# Altium schematic sheet I2C_MUX.SchDoc: Metlino
size 420 x 297 mm; CheckedBy: P.Kulik,T.Przywozki,W.Ruclo; Author: G.Kasprowicz; CompanyName: WUT ISE; DrawnBy: G.Kasprowicz; Organization: WUT ISE; Address1: PW ISE; Address2: Nowowiejska 15/19 00-665 Warsaw; Address3: gkasprow@gmail.com; DocumentNumber: 23; Revision: 2; SheetNumber: 23; SheetTotal: 29; ModifiedBy: -; CheckedDate: -; Title2: I2C switch; DivGrp: WUT ISE; Designer: G.Kasprowicz; ModifiedDate: -; ProjectName: Sensor Box
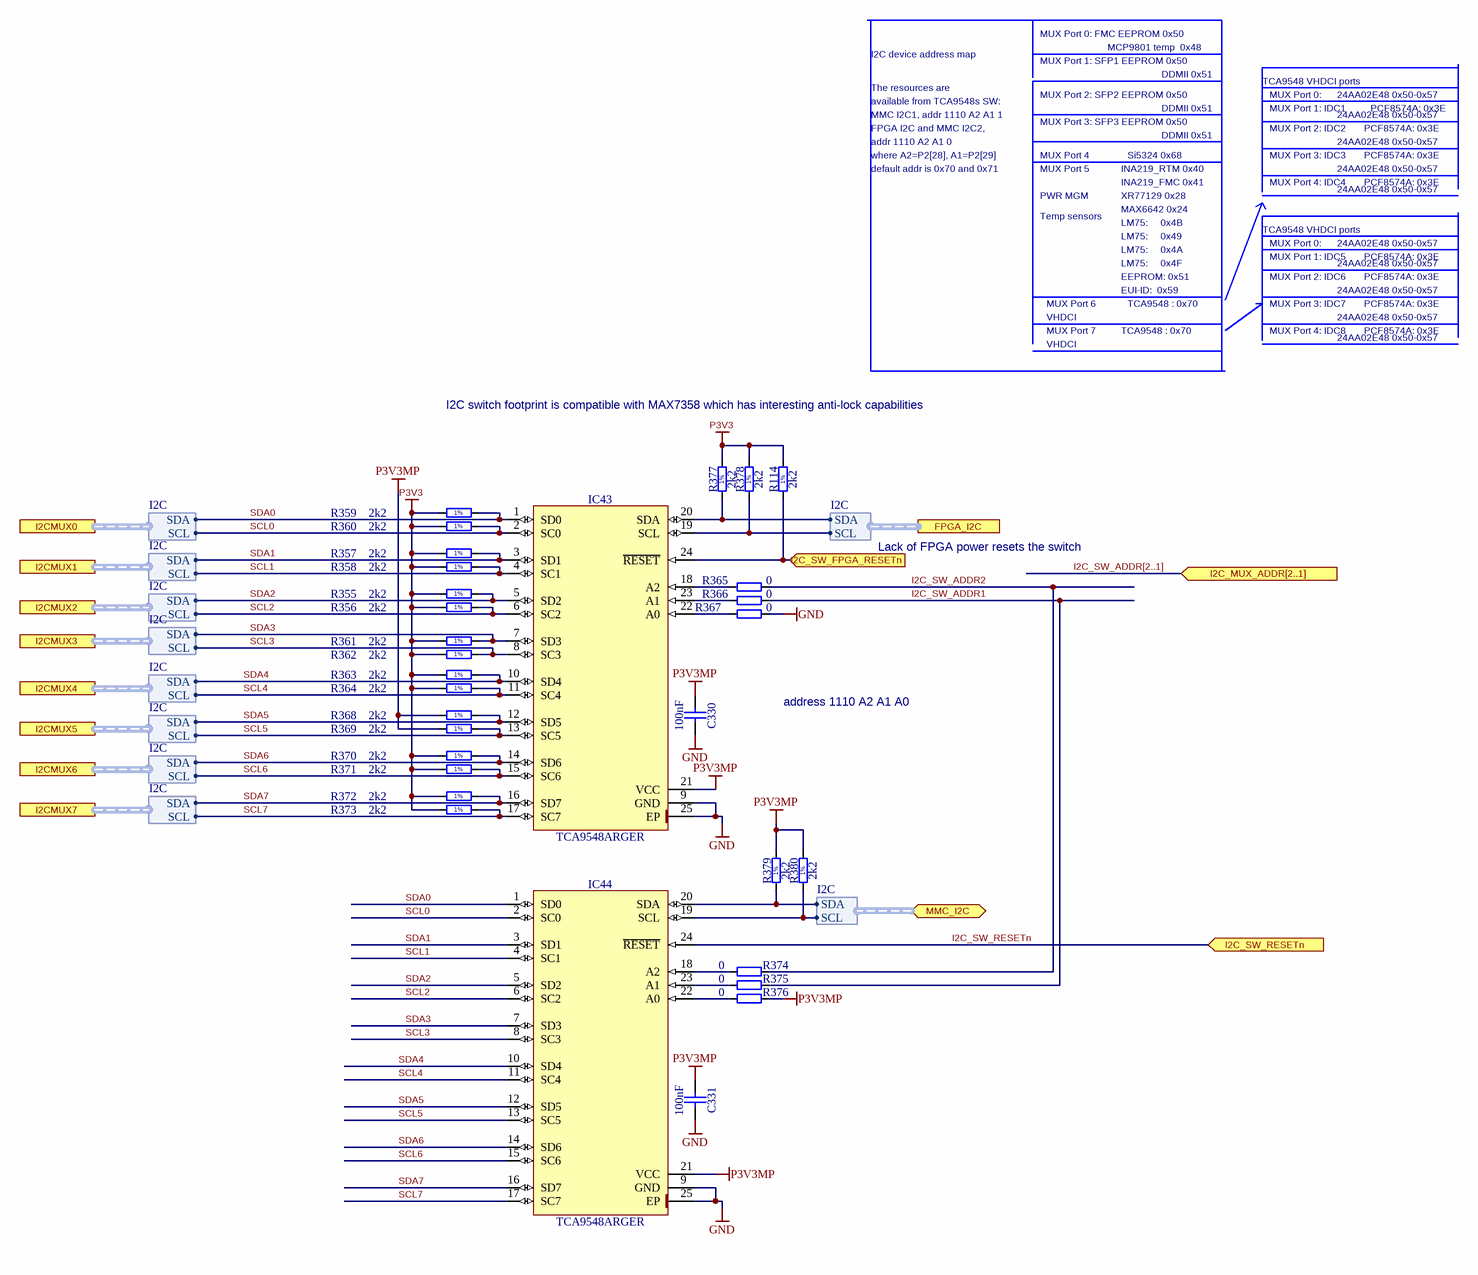
[diagram p0: I2C_MUX.SchDoc]

## Parts
C330  100nF  [CAPC0603X33N]
C331  100nF  [CAPC0603X33N]
IC43  TCA9548ARGER  [QFN50P400X400X100-25N-S220]
IC44  TCA9548ARGER  [QFN50P400X400X100-25N-S220]
R114  2k2  [RESC1005X40N]
R355  2k2  [RESC1005X40N]
R356  2k2  [RESC1005X40N]
R357  2k2  [RESC1005X40N]
R358  2k2  [RESC1005X40N]
R359  2k2  [RESC1005X40N]
R360  2k2  [RESC1005X40N]
R361  2k2  [RESC1005X40N]
R362  2k2  [RESC1005X40N]
R363  2k2  [RESC1005X40N]
R364  2k2  [RESC1005X40N]
R365  0  [RESC1005X40N]
R366  0  [RESC1005X40N]
R367  0  [RESC1005X40N]
R368  2k2  [RESC1005X40N]
R369  2k2  [RESC1005X40N]
R370  2k2  [RESC1005X40N]
R371  2k2  [RESC1005X40N]
R372  2k2  [RESC1005X40N]
R373  2k2  [RESC1005X40N]
R374  0  [RESC1005X40N]
R375  0  [RESC1005X40N]
R376  0  [RESC1005X40N]
R377  2k2  [RESC1005X40N]
R378  2k2  [RESC1005X40N]
R379  2k2  [RESC1005X40N]
R380  2k2  [RESC1005X40N]

## Ports
FPGA_I2C (harness I2C), I2C_MUX_ADDR[2..1] (in), I2C_SW_FPGA_RESETn (in), I2C_SW_RESETn (in), I2CMUX0 (harness I2C), I2CMUX1 (harness I2C), I2CMUX2 (harness I2C), I2CMUX3 (harness I2C), I2CMUX4 (harness I2C), I2CMUX5 (harness I2C), I2CMUX6 (harness I2C), I2CMUX7 (harness I2C), MMC_I2C (bidir, harness I2C)

## Harnesses
I2C: SCL, SDA

## Nets
GND: C330.2 C331.2 IC43.9(GND) IC43.25(EP) IC44.9(GND) IC44.25(EP) R367.1
P3V3: R114.2 R355.1 R356.1 R357.1 R358.1 R359.1 R360.1 R361.1 R362.1 R363.1 R364.1 R370.1 R371.1 R372.1 R373.1 R377.2 R378.2
P3V3MP: C330.1 C331.1 IC43.21(VCC) IC44.21(VCC) R368.1 R369.1 R376.1 R379.2 R380.2
I2C_SW_ADDR1: R366.1 R375.1
I2C_SW_ADDR2: R365.1 R374.1
I2C_SW_FPGA_RESETn: IC43.24(~{RESET}) R114.1 ; port I2C_SW_FPGA_RESETn
I2C_SW_RESETn: IC44.24(~{RESET}) ; port I2C_SW_RESETn
SCL0: IC43.2(SC0) IC44.2(SC0) R360.2 ; port I2CMUX0.SCL
SCL1: IC43.4(SC1) IC44.4(SC1) R358.2 ; port I2CMUX1.SCL
SCL2: IC43.6(SC2) IC44.6(SC2) R356.2 ; port I2CMUX2.SCL
SCL3: IC43.8(SC3) IC44.8(SC3) R362.2 ; port I2CMUX3.SCL
SCL4: IC43.11(SC4) IC44.11(SC4) R364.2 ; port I2CMUX4.SCL
SCL5: IC43.13(SC5) IC44.13(SC5) R369.2 ; port I2CMUX5.SCL
SCL6: IC43.15(SC6) IC44.15(SC6) R371.2 ; port I2CMUX6.SCL
SCL7: IC43.17(SC7) IC44.17(SC7) R373.2 ; port I2CMUX7.SCL
SDA0: IC43.1(SD0) IC44.1(SD0) R359.2 ; port I2CMUX0.SDA
SDA1: IC43.3(SD1) IC44.3(SD1) R357.2 ; port I2CMUX1.SDA
SDA2: IC43.5(SD2) IC44.5(SD2) R355.2 ; port I2CMUX2.SDA
SDA3: IC43.7(SD3) IC44.7(SD3) R361.2 ; port I2CMUX3.SDA
SDA4: IC43.10(SD4) IC44.10(SD4) R363.2 ; port I2CMUX4.SDA
SDA5: IC43.12(SD5) IC44.12(SD5) R368.2 ; port I2CMUX5.SDA
SDA6: IC43.14(SD6) IC44.14(SD6) R370.2 ; port I2CMUX6.SDA
SDA7: IC43.16(SD7) IC44.16(SD7) R372.2 ; port I2CMUX7.SDA
NetIC43_18: IC43.18(A2) R365.2
NetIC43_19: IC43.19(SCL) R378.1 ; port FPGA_I2C.SCL
NetIC43_20: IC43.20(SDA) R377.1 ; port FPGA_I2C.SDA
NetIC43_22: IC43.22(A0) R367.2
NetIC43_23: IC43.23(A1) R366.2
NetIC44_18: IC44.18(A2) R374.2
NetIC44_19: IC44.19(SCL) R380.1 ; port MMC_I2C.SCL
NetIC44_20: IC44.20(SDA) R379.1 ; port MMC_I2C.SDA
NetIC44_22: IC44.22(A0) R376.2
NetIC44_23: IC44.23(A1) R375.2

## Buses and harness runs
bus I2C_SW_ADDR[2..1] = port I2C_MUX_ADDR[2..1]

## Notes on the sheet
- The resources are
- I2C device address map
- MUX Port 0: FMC EEPROM 0x50
- MUX Port 1: SFP1 EEPROM 0x50
- MCP9801 temp  0x48
- DDMII 0x51
- TCA9548 VHDCI ports
- FPGA I2C and MMC I2C2,
- where A2=P2[28], A1=P2[29]
- available from TCA9548s SW:
- MMC I2C1, addr 1110 A2 A1 1
- addr 1110 A2 A1 0
- MUX Port 4
- MUX Port 2: SFP2 EEPROM 0x50
- MUX Port 3: SFP3 EEPROM 0x50
- Si5324 0x68
- MUX Port 1: IDC1
- MUX Port 0:
- MUX Port 3: IDC3
- MUX Port 2: IDC2
- 24AA02E48 0x50-0x57
- PCF8574A: 0x3E
- default addr is 0x70 and 0x71
- MUX Port 5
- PWR MGM
- Temp sensors
- XR77129 0x28
- INA219_FMC 0x41
- INA219_RTM 0x40
- MAX6642 0x24
- LM75:     0x4B
- MUX Port 4: IDC4
- EEPROM: 0x51
- EUI-ID:  0x59
- LM75:     0x4F
- LM75:     0x4A
- LM75:     0x49
- MUX Port 2: IDC6
- MUX Port 1: IDC5
- MUX Port 6
- MUX Port 7
- VHDCI
- TCA9548 : 0x70
- MUX Port 4: IDC8
- MUX Port 3: IDC7
- I2C switch footprint is compatible with MAX7358 which has interesting anti-lock capabilities
- Lack of FPGA power resets the switch
- address 1110 A2 A1 A0
- Project/Equipment
- Document
- Designer
- Drawn by
- Check.by
- Copyright WUT ISE 2018.
  This documentation describes Open Hardware and is licensed under the CERN OHL v.1.1. You may redistribute and modify this documentation under the terms of the CERN OHL v.1.1. (http://ohwr.org/CERNOHL). This documentation is distributed WITHOUT ANY EXPRESS OR IMPLIED WARRANTY, INCLUDING OF MERCHANTABILITY, SATISFACTORY QUALITY AND FITNESS FOR A PARTICULAR PURPOSE. Please see the CERN OHL v.1.1 for applicable conditions.
- Contact
- File
- Last Mod.
- Print Date
- Sheet
- Size
- A3
- of
- Rev
- (in symbol R0402_2K2_1%_0.0625W_100PPM) 1%

## Library data of the parts
C330 C331 = CC0201_100NF_6.3V_10%_X5R: Non-polarised capacitor; Manufacturer: GENERIC; Part Description: SMD Multilayer Chip Ceramic Capacitor; Manufacturer1 Part Number: 02016D104KAT2A; Tolerance: ±10%; Voltage: 6.3V; TC: X5R; Manufacturer Part Number: CC0201_100NF_6.3V_10%_X5R; Part Number: CC0201_100NF_6.3V_10%_X5R; Value: 100nF; Component Kind: Standard; Component Type: Standard; Pin Count: 2; Status: Not Recommended; Case: 0201; Mounted: Yes; Socket: No; SMD: Yes; Sense: No; Manufacturer1 Example: AVX; Manufacturer1 ComponentHeight: 0.33mm; HelpURL: \\cern.ch\dfs\Applications\Altium\Datasheets\CC0201_X5R_AVX.pdf; Author: CERN DEM JLC; CreateDate: 03.12.2007; LatestRevisionDate: 03.12.2007
IC43 IC44 = TCA9548ARGER: Low Voltage 8-Channel I2C Switch With Reset; Manufacturer: TEXAS INSTRUMENTS; PressFit: No; Bonding: No; Manufacturer Part Number: TCA9548ARGER; PackageDescription: QFN, 0.50mm Pitch, Square; 24 Pin, 4.00mm L X 4.00mm W X 1.00mm H body (w/thermal tab 2.2 X 2.2mm), IPC Medium Density; Part Description: Low Voltage 8-Channel I2C Switch With Reset; Part Number: TCA9548ARGER; Component Kind: Standard; Component Type: Standard; Device: TCA9548ARGER; Pin Count: 25; Case: QFN24; Mounted: Yes; Socket: No; SMD: Yes; Sense: No; ComponentHeight: 1mm; Author: CERN DEM JLC; HelpURL: \\cern.ch\dfs\Applications\Altium\Datasheets\TCA9548ARGER.pdf; CreateDate: 07.07.2014; LatestRevisionDate: 07.07.2014
R114 R355-R364 R368-R373 R377-R380 = R0402_2K2_1%_0.0625W_100PPM: Resistor - 1%; Manufacturer: GENERIC; Part Description: General Purpose Thick Film Chip Resistor; Manufacturer1 Part Number: 232270672202L; TC: ±100ppm/°C; PressFit: No; Manufacturer Part Number: R0402_2K2_1%_0.0625W_100PPM; Part Number: R0402_2K2_1%_0.0625W_100PPM; Tolerance: ±1%; Value: 2k2; Component Kind: Standard; Component Type: Standard; Pin Count: 2; Status: Not Recommended; Power: 0.0625W; Case: 0402; Mounted: Yes; Sense: No; Socket: No; SMD: Yes; Manufacturer1 Example: YAGEO PHYCOMP; Manufacturer1 ComponentHeight: 0.4mm; HelpURL: \\cern.ch\dfs\Applications\Altium\Datasheets\R0402_Phycomp_RC0402.pdf; Author: CERN DEM JLC; CreateDate: 03.12.2007; LatestRevisionDate: 17.10.2012
R365-R367 R374-R376 = R0402_0R_JUMPER: Resistor; Manufacturer: GENERIC; Part Description: 1A (0.05R Max DC Resistance) Zero Ohm Jumper; Manufacturer1 Part Number: 232270591001L; PressFit: No; Manufacturer Part Number: R0402_0R_JUMPER; Part Number: R0402_0R_JUMPER; Value: 0; Component Kind: Standard; Component Type: Standard; Pin Count: 2; Status: Not Recommended; Case: 0402; Mounted: Yes; Sense: No; Socket: No; SMD: Yes; Manufacturer1 Example: YAGEO PHYCOMP; Manufacturer1 ComponentHeight: 0.4mm; HelpURL: \\cern.ch\dfs\Applications\Altium\Datasheets\R0402_Phycomp_RC0402.pdf; Author: CERN DEM JLC; CreateDate: 03.12.2007; LatestRevisionDate: 17.10.2012